# Altium schematic sheet 主控板原理图.SchDoc
size A3
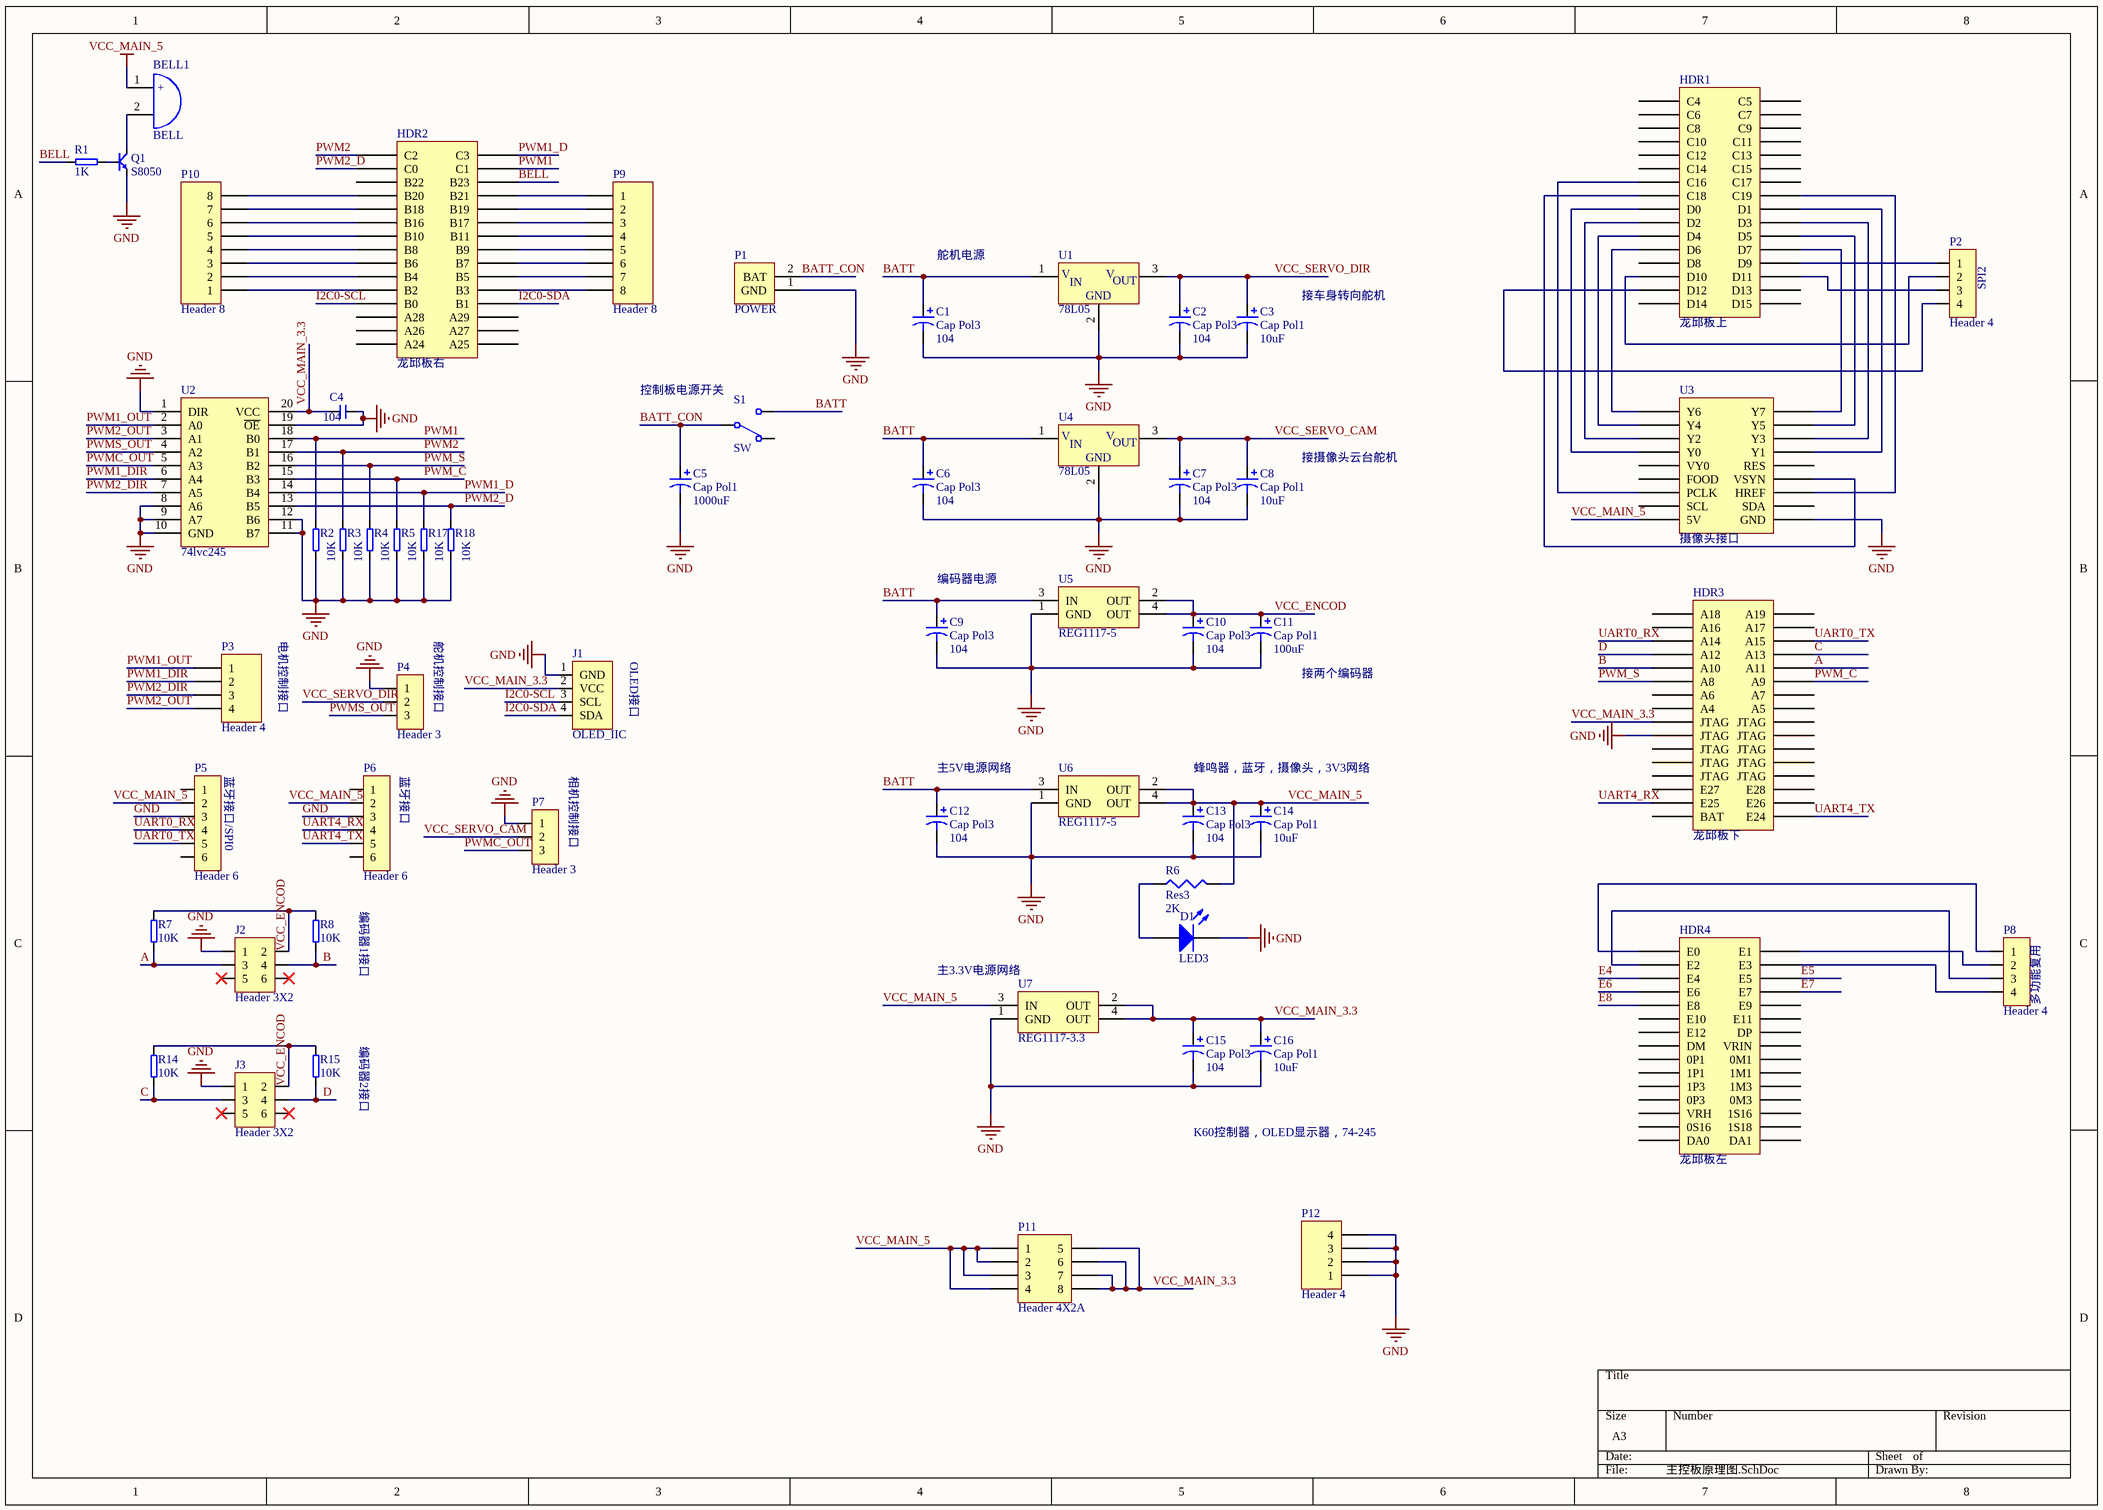
[diagram p0: 主控板原理图.SchDoc]

## Parts
BELL1  BELL  [BUZZER]
C1  Cap Pol3  value 104  [C0805]
C2  Cap Pol3  value 104  [C0805]
C3  Cap Pol1  value 10uF  [3216-CAP-TA]
C4  104  [0603-CAP]
C5  Cap Pol1  value 1000uF  [CAPP]
C6  Cap Pol3  value 104  [C0805]
C7  Cap Pol3  value 104  [C0805]
C8  Cap Pol1  value 10uF  [3216-CAP-TA]
C9  Cap Pol3  value 104  [C0805]
C10  Cap Pol3  value 104  [C0805]
C11  Cap Pol1  value 100uF  [RB.1/.2]
C12  Cap Pol3  value 104  [C0805]
C13  Cap Pol3  value 104  [C0805]
C14  Cap Pol1  value 10uF  [3216-CAP-TA]
C15  Cap Pol3  value 104  [C0805]
C16  Cap Pol1  value 10uF  [3216-CAP-TA]
D1  LED3  [3.5X2.8X1.9]
HDR1  龙邱板上  [HDR2X16_CEN]
HDR2  龙邱板右  [HDR2X15_CEN]
HDR3  龙邱板下  [HDR2X16_CEN]
HDR4  龙邱板左  [HDR2X15_CEN]
J1  OLED_IIC  [Header 4]
J2  Header 3X2  [IDC3*2]
J3  Header 3X2  [IDC3*2]
P1  POWER  [POWER]
P2  Header 4  [Header 4]
P3  Header 4  [HDR1X4]
P4  Header 3  [Header 3]
P5  Header 6  [Header 6]
P6  Header 6  [Header 6]
P7  Header 3  [Header 3]
P8  Header 4  [Header 4]
P9  Header 8  [HDR1X8]
P10  Header 8  [HDR1X8]
P11  Header 4X2A  [HDR2X4_CEN]
P12  Header 4  [HDR1X4]
Q1  S8050  [8050]
R1  1K  [0603-RES]
R2  10K  [0603-RES]
R3  10K  [0603-RES]
R4  10K  [0603-RES]
R5  10K  [0603-RES]
R6  Res3  value 2K  [J1-0603]
R7  10K  [0603-RES]
R8  10K  [0603-RES]
R14  10K  [0603-RES]
R15  10K  [0603-RES]
R17  10K  [0603-RES]
R18  10K  [0603-RES]
S1  SW  [SW]
U1  78L05  [78XX]
U2  74lvc245  [74lvc245 TSSOP20]
U3  摄像头接口  [HDR2X9_CEN]
U4  78L05  [78XX]
U5  REG1117-5  [ZZ311]
U6  REG1117-5  [ZZ311]
U7  REG1117-3.3  [ZZ311]

## Nets
GND: C1.2 C2.2 C3.2 C4.2 C5.2 C6.2 C7.2 C8.2 C9.2 C10.2 C11.2 C12.2 C13.2 C14.2 C15.2 C16.2 D1.2(K) HDR3.23(JTAG) J1.1(GND) J2.1 J3.1 P1.1(GND) P4.1 P5.3 P6.3 P7.1 P12.1 P12.2 P12.3 P12.4 Q1.2 R2.1 R3.1 R4.1 R5.1 R17.1 R18.1 U1.2(GND) U2.1(DIR) U2.8(A6) U2.9(A7) U2.10(GND) U2.11(B7) U2.12(B6) U2.19(~{OE}) U3.1(GND) U4.2(GND) U5.1(GND) U6.1(GND) U7.1(GND)
VCC_MAIN_5: BELL1.1(+) C13.1 C14.1 P5.2 P6.2 P11.1 P11.2 P11.3 P11.4 R6.2 U3.10(5V) U6.2(OUT) U6.4(OUT) U7.3(IN)
A: HDR3.12(A11) J2.3 R7.1
B: HDR3.28(A10) J2.4 R8.1
BATT: C1.1 C6.1 C9.1 C12.1 S1.3 U1.1(VIN) U4.1(VIN) U5.3(IN) U6.3(IN)
BATT_CON: C5.1 P1.2(BAT) S1.2
BELL: HDR2.18(B23) R1.1
C: HDR3.13(A13) J3.3 R14.1
D: HDR3.29(A12) J3.4 R15.1
E4: HDR4.3(E4)
E5: HDR4.18(E5)
E6: HDR4.4(E6)
E7: HDR4.19(E7)
E8: HDR4.5(E8)
I2C0-SCL: HDR2.12(B0) J1.3(SCL)
I2C0-SDA: HDR2.27(B1) J1.4(SDA)
PWM1: HDR2.17(C1) R2.2 U2.18(B0)
PWM1_D: HDR2.16(C3) R17.2 U2.14(B4)
PWM1_DIR: P3.2 U2.6(A4)
PWM1_OUT: P3.1 U2.2(A0)
PWM2: HDR2.1(C2) R3.2 U2.17(B1)
PWM2_D: HDR2.2(C0) R18.2 U2.13(B5)
PWM2_DIR: P3.3 U2.7(A5)
PWM2_OUT: P3.4 U2.3(A1)
PWM_C: HDR3.11(A9) R5.2 U2.15(B3)
PWM_S: HDR3.27(A8) R4.2 U2.16(B2)
PWMC_OUT: P7.3 U2.5(A3)
PWMS_OUT: P4.3 U2.4(A2)
UART0_RX: HDR3.30(A14) P5.4
UART0_TX: HDR3.14(A15) P5.5
UART4_RX: HDR3.18(E25) P6.4
UART4_TX: HDR3.1(E24) P6.5
VCC_ENCOD: C10.1 C11.1 J2.2 J3.2 R7.2 R8.2 R14.2 R15.2 U5.2(OUT) U5.4(OUT)
VCC_MAIN_3.3: C4.1 C15.1 C16.1 HDR3.24(JTAG) J1.2(VCC) P11.5 P11.6 P11.7 P11.8 U2.20(VCC) U7.2(OUT) U7.4(OUT)
VCC_SERVO_CAM: C7.1 C8.1 P7.2 U4.3(VOUT)
VCC_SERVO_DIR: C2.1 C3.1 P4.2 U1.3(VOUT)
NetBELL1_2: BELL1.2 Q1.3
NetD1_1: D1.1(A) R6.1
NetHDR1_3: HDR1.3(D11) P2.3
NetHDR1_4: HDR1.4(D9) P2.1
NetHDR1_5: HDR1.5(D7) U3.9(Y7)
NetHDR1_6: HDR1.6(D5) U3.8(Y5)
NetHDR1_7: HDR1.7(D3) U3.7(Y3)
NetHDR1_8: HDR1.8(D1) U3.6(Y1)
NetHDR1_9: HDR1.9(C19) U3.3(HREF)
NetHDR1_18: HDR1.18(D12) P2.4
NetHDR1_19: HDR1.19(D10) P2.2
NetHDR1_21: HDR1.21(D6) U3.18(Y6)
NetHDR1_22: HDR1.22(D4) U3.17(Y4)
NetHDR1_23: HDR1.23(D2) U3.16(Y2)
NetHDR1_24: HDR1.24(D0) U3.15(Y0)
NetHDR1_25: HDR1.25(C18) U3.4(VSYN)
NetHDR1_26: HDR1.26(C16) U3.12(PCLK)
NetHDR2_4: HDR2.4(B20) P10.8
NetHDR2_5: HDR2.5(B18) P10.7
NetHDR2_6: HDR2.6(B16) P10.6
NetHDR2_7: HDR2.7(B10) P10.5
NetHDR2_8: HDR2.8(B8) P10.4
NetHDR2_9: HDR2.9(B6) P10.3
NetHDR2_10: HDR2.10(B4) P10.2
NetHDR2_11: HDR2.11(B2) P10.1
NetHDR2_19: HDR2.19(B21) P9.1
NetHDR2_20: HDR2.20(B19) P9.2
NetHDR2_21: HDR2.21(B17) P9.3
NetHDR2_22: HDR2.22(B11) P9.4
NetHDR2_23: HDR2.23(B9) P9.5
NetHDR2_24: HDR2.24(B7) P9.6
NetHDR2_25: HDR2.25(B5) P9.7
NetHDR2_26: HDR2.26(B3) P9.8
NetHDR4_1: HDR4.1(E0) P8.1
NetHDR4_2: HDR4.2(E2) P8.3
NetHDR4_16: HDR4.16(E1) P8.2
NetHDR4_17: HDR4.17(E3) P8.4
NetQ1_1: Q1.1 R1.2

Not connected (* = marked no-connect by the designer): HDR1 1(D15) 2(D13) 10(C17) 11(C15) 12(C13) 13(C11) 14(C9) 15(C7) 16(C5) 17(D14) 20(D8) 27(C14) 28(C12) 29(C10) 30(C8) 31(C6) 32(C4); HDR2 3(B22) 13(A28) 14(A26) 15(A24) 28(A29) 29(A27) 30(A25); HDR3 2(E26) 3(E28) 4(JTAG) 5(JTAG) 6(JTAG) 7(JTAG) 8(JTAG) 9(A5) 10(A7) 15(A17) 16(A19) 17(BAT) 19(E27) 20(JTAG) 21(JTAG) 22(JTAG) 25(A4) 26(A6) 31(A16) 32(A18); HDR4 6(E10) 7(E12) 8(DM) 9(0P1) 10(1P1) 11(1P3) 12(0P3) 13(VRH) 14(0S16) 15(DA0) 20(E9) 21(E11) 22(DP) 23(VRIN) 24(0M1) 25(1M1) 26(1M3) 27(0M3) 28(1S16) 29(1S18) 30(DA1); J2 5* 6*; J3 5* 6*; P5 1 6; P6 1 6; S1 1; U3 2(SDA) 5(RES) 11(SCL) 13(FOOD) 14(VY0)

## Notes on the sheet
- 舵机电源
- 接车身转向舵机
- (near P2) SPI2
- 控制板电源开关
- 接摄像头云台舵机
- (near C9) 编码器电源
- 电机控制接口
- (near P4) 舵机控制接口
- OLED接口
- (near C11) 接两个编码器
- (near P5) 蓝牙接口/SPI0
- (near P6) 蓝牙接口
- (near P7) 相机控制接口
- (near C12) 主5V电源网络
- 蜂鸣器，蓝牙，摄像头，3V3网络
- 编码器1接口
- (near U7) 主3.3V电源网络
- (near R15) 编码器2接口
- (near P8) 多功能复用
- K60控制器，OLED显示器，74-245
- (in symbol 78L05) V; IN; OUT

## Library data of the parts
C1 C2 C6 C7 C9 C10 C12 C13 C15 = Cap Pol3: Polarized Capacitor (Surface Mount); Published: 8-Jun-2000; LatestRevisionDate: 29-May-2009; LatestRevisionNote: IPC-7351 Footprint Added.; PackageReference: C0805; Publisher: Altium Limited; PackageDescription: Chip Capacitor
C3 C5 C8 C11 C14 C16 = Cap Pol1: Polarized Capacitor (Radial); Published: 8-Jun-2000; LatestRevisionDate: 17-Jul-2002; LatestRevisionNote: Re-released for DXP Platform.; PackageReference: RB7.6-15; Publisher: Altium Limited; PackageDescription: Polarized Capacitor (Radial); 2 Leads
C4 = CAP_0603
D1 = LED3: Typical BLUE SiC LED; Published: 8-Jun-2000; LatestRevisionDate: 17-Dec-2003; LatestRevisionNote: PCB Footprint replaced.; DatasheetVersion: 16-Apr-2002; PackageVersion: 16-Apr-2002; PackageReference: 3.5X2.8X1.9; Publisher: Altium Limited; PackageDescription: SM LED; 2 C-Bend Leads; Body 3.5 x 2.8 x 1.9 mm, inc leads (LxWxH typ)
P3 P12 = Header 4: Header, 4-Pin; LatestRevisionDate: 17-Jul-2002; LatestRevisionNote: Re-released for DXP Platform.; Publisher: Altium Limited
P9 P10 = Header 8: Header, 8-Pin; LatestRevisionDate: 17-Jul-2002; LatestRevisionNote: Re-released for DXP Platform.; Publisher: Altium Limited
P11 = Header 4X2A: Header, 4-Pin, Dual row; LatestRevisionDate: 17-Jul-2002; LatestRevisionNote: Re-released for DXP Platform.; Publisher: Altium Limited
Q1 = NPN
R1-R5 R7 R8 R14 R15 R17 R18 = RES_0603
R6 = Res3: Resistor; Published: 8-Jun-2000; LatestRevisionDate: 29-May-2009; LatestRevisionNote: IPC-7351 Footprint Added.; PackageReference: J1-0603; Publisher: Altium Limited; PackageDescription: Chip Resistor
U1 U4 = 78L05: 3-Terminal Positive Voltage Regulator
U5 U6 = REG1117-5: 800mA and 1A Low Dropout Positive Regulator 2.85V, 3.3V, 5V, and Adjustable; Published: 8-Jun-2000; LatestRevisionDate: 17-Jul-2002; LatestRevisionNote: Re-released for DXP Platform.; DatasheetVersion: Sep-1997; PackageVersion: revC; PackageReference: ZZ311; Publisher: Altium Limited; PackageDescription: SOT-223/SC-73; 4 Leads; Body 6.7 x 7.3 mm, inc. leads (LxW max); ComponentLink1Description: Manufacturer Link; ComponentLink1URL: http://www.ti.com/; ComponentLink2Description: Datasheet; ComponentLink2URL: http://www-s.ti.com/sc/ds/REG1117.pdf
U7 = REG1117-3.3: 800mA and 1A Low Dropout Positive Regulator 2.85V, 3.3V, 5V, and Adjustable; Published: 8-Jun-2000; LatestRevisionDate: 17-Jul-2002; LatestRevisionNote: Re-released for DXP Platform.; DatasheetVersion: Sep-1997; PackageVersion: revC; PackageReference: ZZ311; Publisher: Altium Limited; PackageDescription: SOT-223/SC-73; 4 Leads; Body 6.7 x 7.3 mm, inc. leads (LxW max); ComponentLink1Description: Manufacturer Link; ComponentLink1URL: http://www.ti.com/; ComponentLink2Description: Datasheet; ComponentLink2URL: http://www-s.ti.com/sc/ds/REG1117.pdf